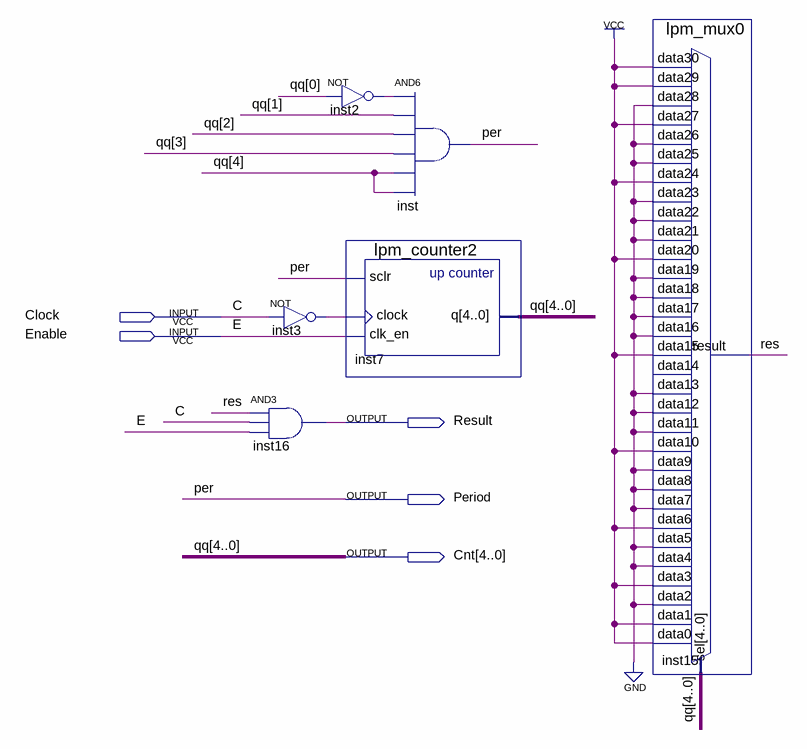
[diagram p0: schematic sheet]
// Quartus schematic mux_scheme.bdf as structural Verilog: 6 symbols, 5 pins
module mux_scheme (
  input  Clock,
  input  Enable,
  output Result,
  output Period,
  output [4:0] Cnt
);

  wire inst2_out, inst3_out, res;

  not inst3 (inst3_out, Clock);
  and inst16 (Result, res, Clock, Enable);
  not inst2 (inst2_out, Cnt[0]);
  lpm_counter2 inst7 (.sclr(Period), .clock(inst3_out), .clk_en(Enable), .q(Cnt));
  and inst (Period, inst2_out, Cnt[1], Cnt[2], Cnt[3], Cnt[4], Cnt[4]);
  lpm_mux0 inst15 (
    .data30(1'b1), .data29(1'b1), .data28(1'b0), .data27(1'b1), .data26(1'b0), .data25(1'b0), .data24(1'b1),
    .data23(1'b0), .data22(1'b0), .data21(1'b0), .data20(1'b1), .data19(1'b0), .data18(1'b0), .data17(1'b0),
    .data16(1'b0), .data15(1'b1), .data13(1'b0), .data12(1'b0), .data11(1'b0), .data10(1'b1), .data9(1'b0),
    .data8(1'b0), .data7(1'b0), .data6(1'b1), .data5(1'b0), .data4(1'b0), .data3(1'b1), .data2(1'b0),
    .data1(1'b1), .data0(1'b1), .sel(Cnt), .result(res));  // open: data14

  // Other names for the same wires on the sheet: C = Clock; E = Enable; per = Period; qq[4:0] = Cnt
endmodule
